# EAGLE design BeoModern_display (EAGLE 8.6.3)
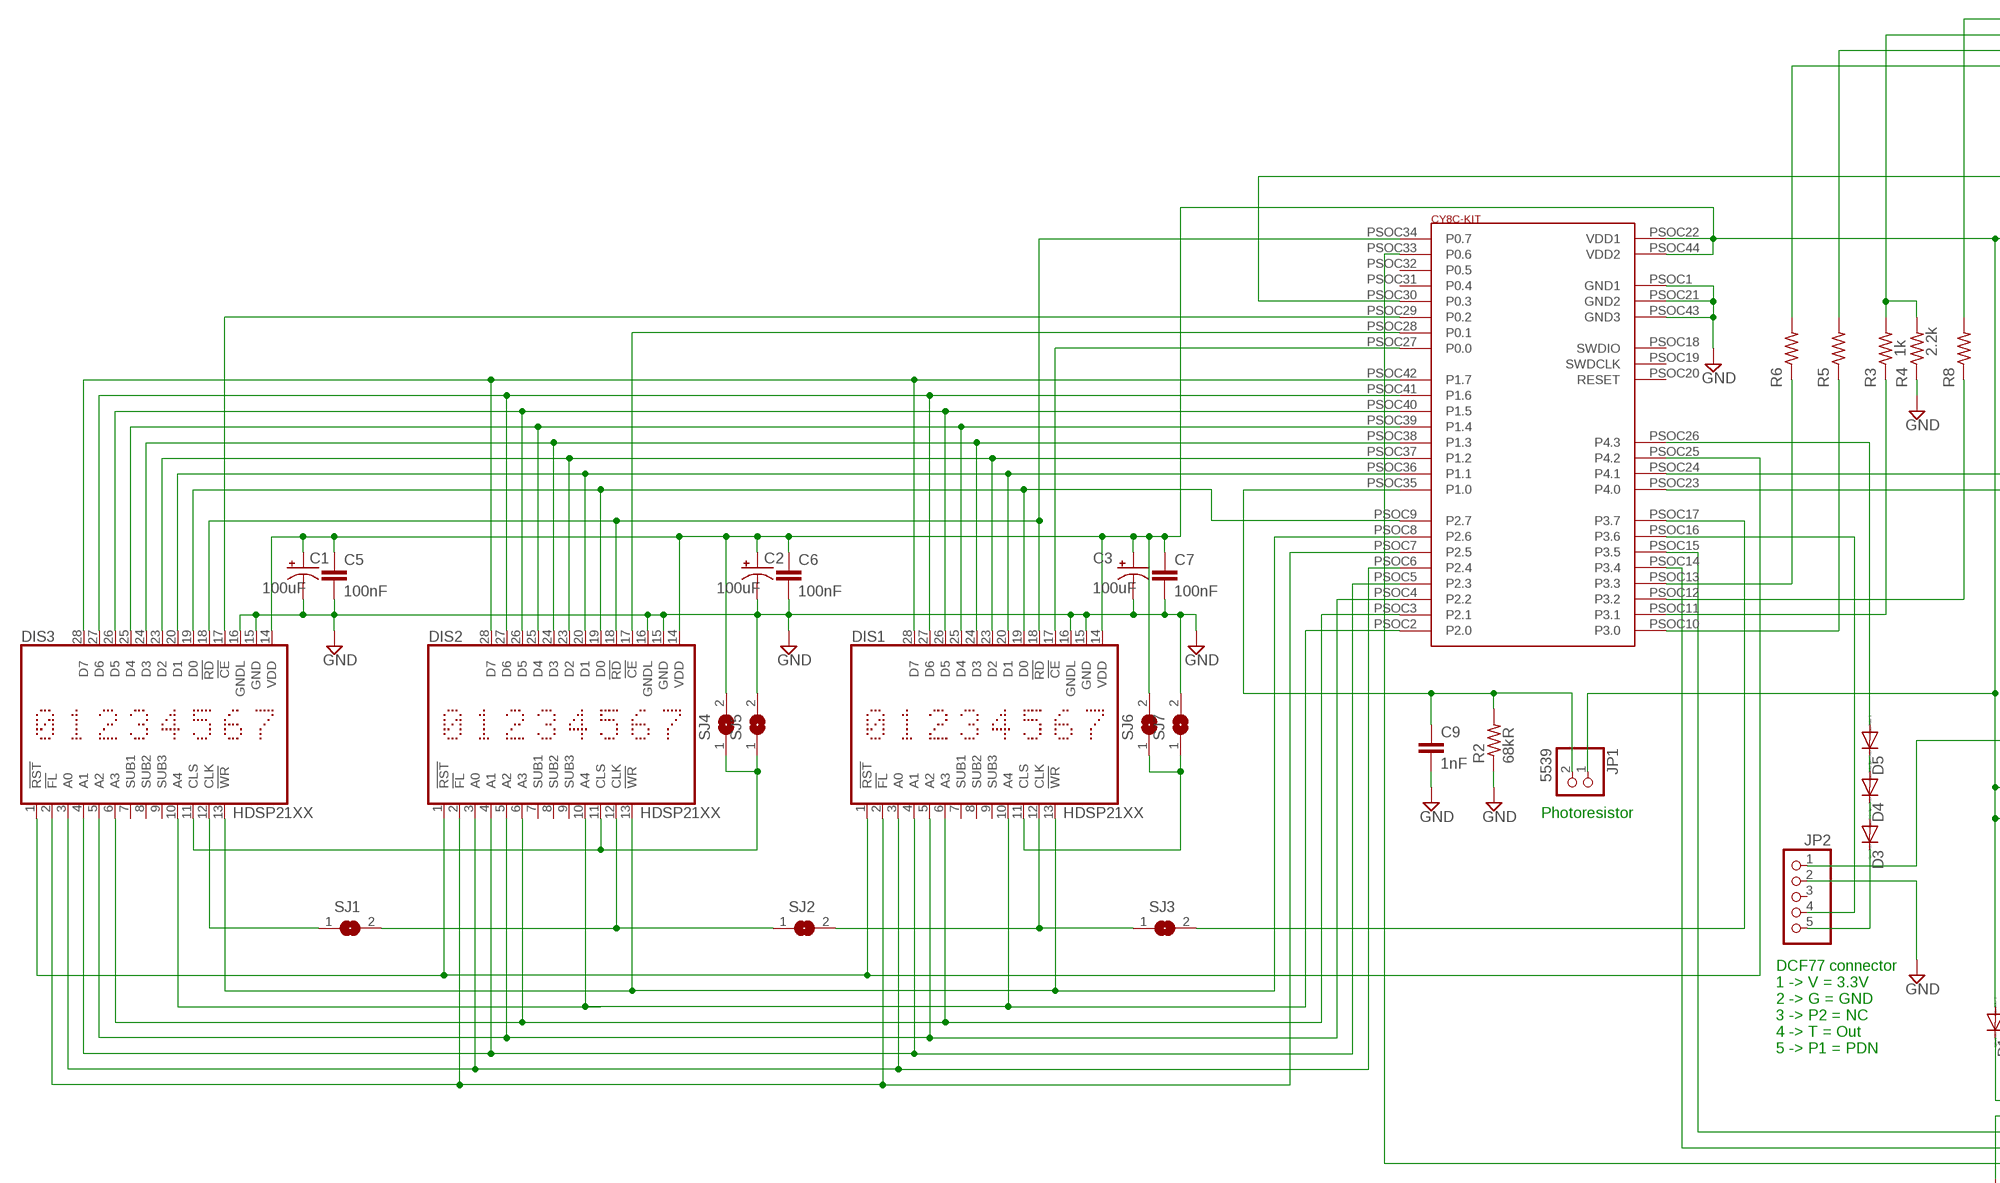
[diagram p0: schematic, sheet 1, part 1 of 2]
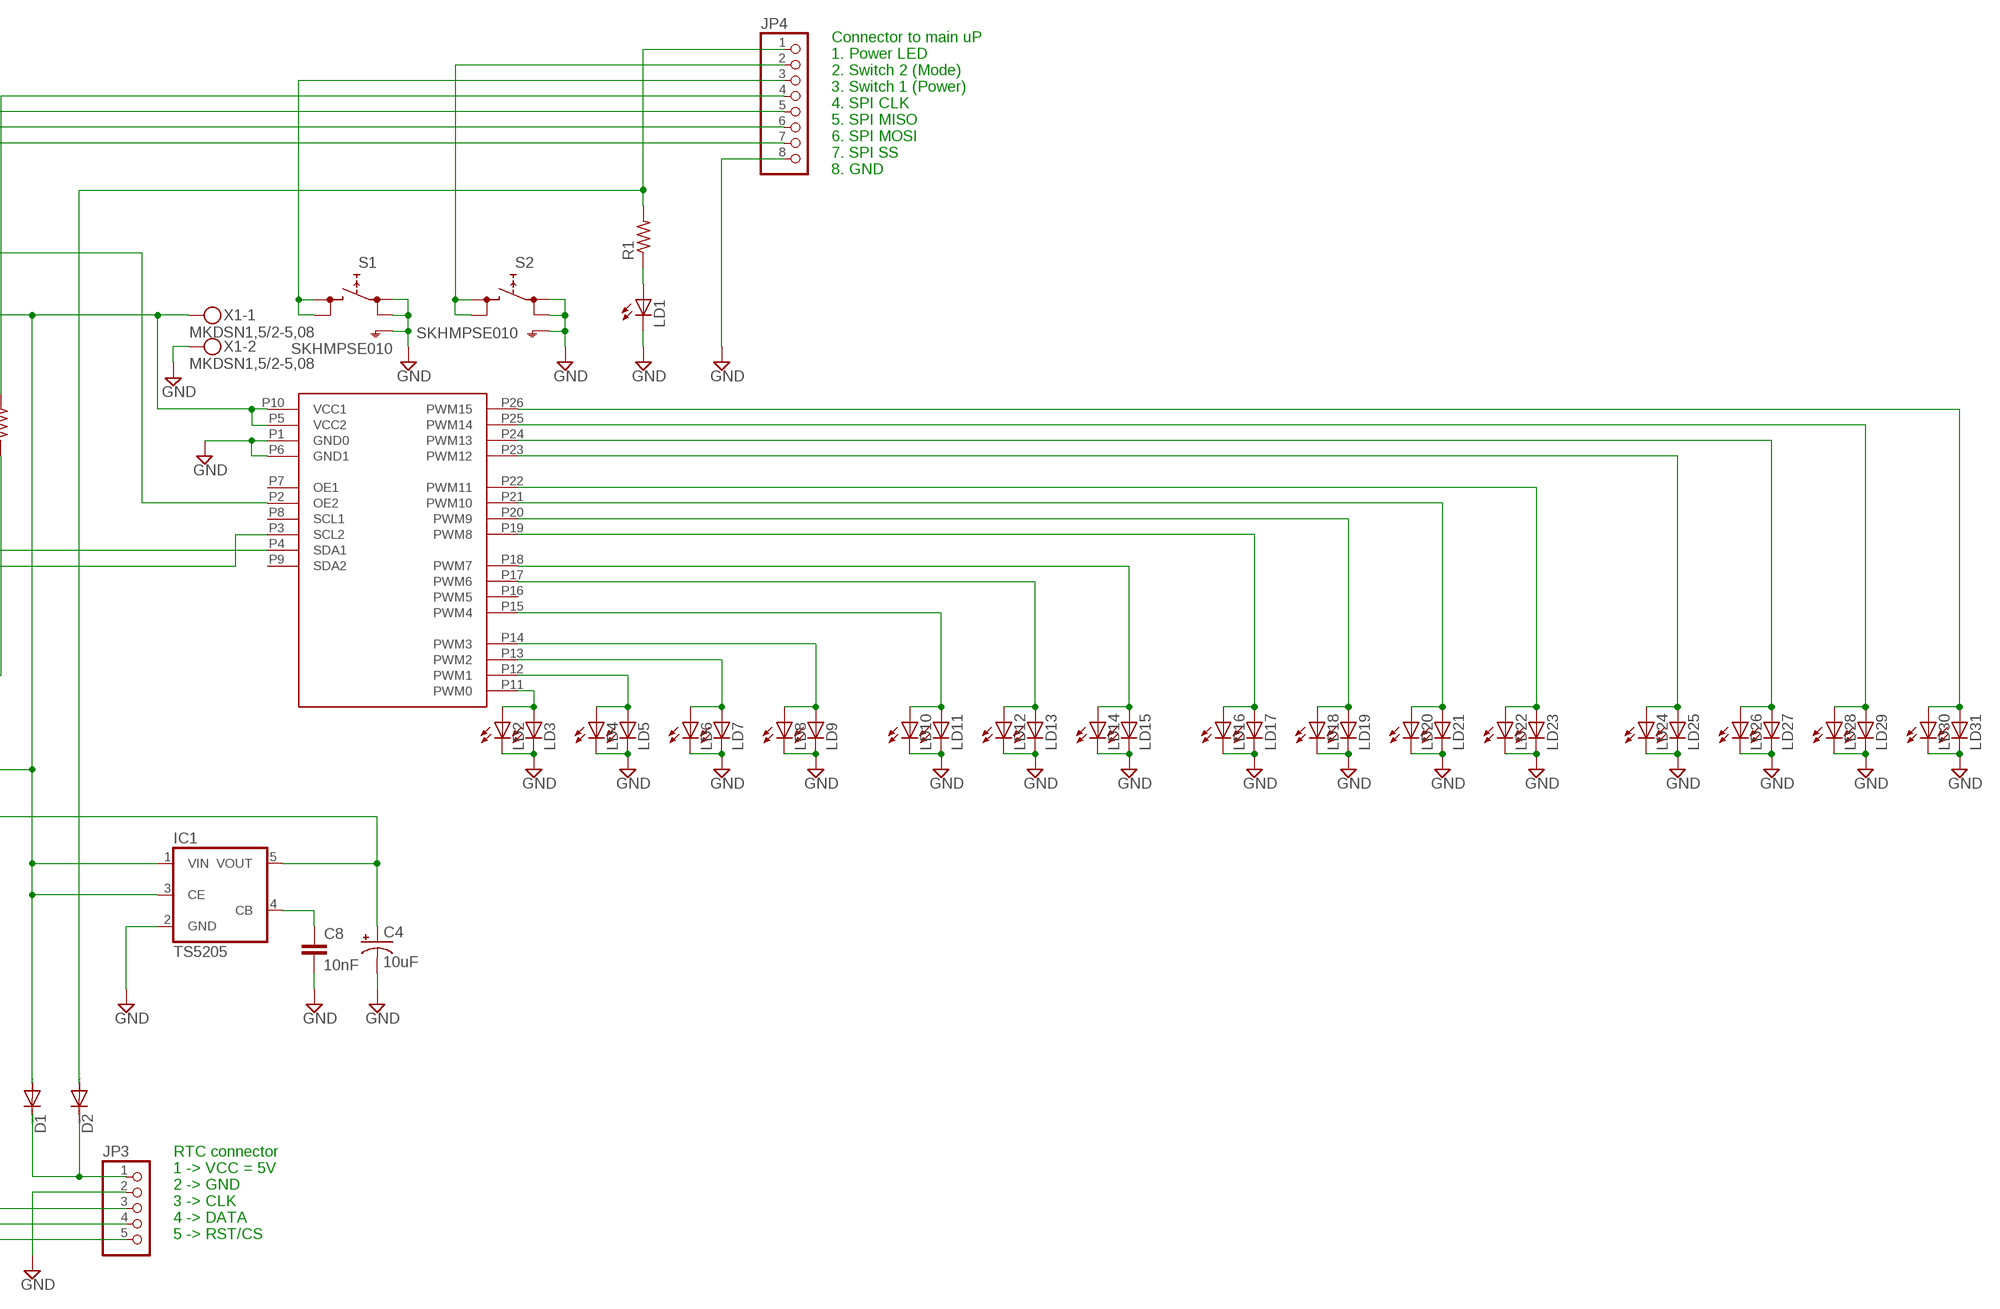
[diagram p1: schematic, sheet 1, part 2 of 2]

## Parts
C1  100uF  CPOL-USE15-5AXIAL  [E15-5]
C2  100uF  CPOL-USE15-5AXIAL  [E15-5]
C3  100uF  CPOL-USE15-5AXIAL  [E15-5]
C4  10uF  CPOL-USE2.5-5  [E2,5-5]
C5  100nF  C15/5  [C15B5]
C6  100nF  C15/5  [C15B5]
C7  100nF  C15/5  [C15B5]
C8  10nF  C2.5/2  [C2.5-2]
C9  1nF  C2.5/2  [C2.5-2]
D1  DIODE-SOD80C  [SOD80C]
D2  DIODE-SOD80C  [SOD80C]
D3  DIODE-SOD80C  [SOD80C]
D4  DIODE-SOD80C  [SOD80C]
D5  DIODE-SOD80C  [SOD80C]
DIS1  HDSP21XX  [HDSP21XX]
DIS2  HDSP21XX  [HDSP21XX]
DIS3  HDSP21XX  [HDSP21XX]
IC1  TS5205  [SOT25]
JP1  5539  PINHD-1X2  [1X02]
JP2  PINHD-1X5  [1X05]
JP3  PINHD-1X5  [1X05]
JP4  PINHD-1X8  [1X08]
LD1  TLLR4400  [LED3MM]
LD2  TLLR4400  [LED3MM]
LD3  TLLR4400  [LED3MM]
LD4  TLLR4400  [LED3MM]
LD5  TLLR4400  [LED3MM]
LD6  TLLR4400  [LED3MM]
LD7  TLLR4400  [LED3MM]
LD8  TLLR4400  [LED3MM]
LD9  TLLR4400  [LED3MM]
LD10  TLLR4400  [LED3MM]
LD11  TLLR4400  [LED3MM]
LD12  TLLR4400  [LED3MM]
LD13  TLLR4400  [LED3MM]
LD14  TLLR4400  [LED3MM]
LD15  TLLR4400  [LED3MM]
LD16  TLLR4400  [LED3MM]
LD17  TLLR4400  [LED3MM]
LD18  TLLR4400  [LED3MM]
LD19  TLLR4400  [LED3MM]
LD20  TLLR4400  [LED3MM]
LD21  TLLR4400  [LED3MM]
LD22  TLLR4400  [LED3MM]
LD23  TLLR4400  [LED3MM]
LD24  TLLR4400  [LED3MM]
LD25  TLLR4400  [LED3MM]
LD26  TLLR4400  [LED3MM]
LD27  TLLR4400  [LED3MM]
LD28  TLLR4400  [LED3MM]
LD29  TLLR4400  [LED3MM]
LD30  TLLR4400  [LED3MM]
LD31  TLLR4400  [LED3MM]
R1  R-US_0207/10  [0207/10]
R2  68kR  R-US_0207/10  [0207/10]
R3  1k  R-US_0207/10  [0207/10]
R4  2.2k  R-US_0207/10  [0207/10]
R5  R-US_0207/10  [0207/10]
R6  R-US_0207/10  [0207/10]
R8  R-US_0207/10  [0207/10]
S1  SKHMPSE010  [SKHMPXE010]
S2  SKHMPSE010  [SKHMPXE010]
SJ1  SJ  [SJ]
SJ2  SJ  [SJ]
SJ3  SJ  [SJ]
SJ4  SJ  [SJ]
SJ5  SJ  [SJ]
SJ6  SJ  [SJ]
SJ7  SJ  [SJ]
U$9  CY8C-KIT  [CY8C-KIT-FOOTPRINT]
U$10  PCA9685  [PCA9685_FOOTPRINT]
X1  MKDSN1,5/2-5,08  [MKDSN1,5/2-5,08]

## Nets
GND: C1.- C2.- C3.- C4.- C5.2 C6.2 C7.2 C8.2 C9.2 DIS1.15(GND) DIS1.16(GNDL) DIS2.15(GND) DIS2.16(GNDL) DIS3.15(GND) DIS3.16(GNDL) IC1.2(GND) JP2.2 JP3.2 JP4.8 LD1.K(C) LD2.K(C) LD3.K(C) LD4.K(C) LD5.K(C) LD6.K(C) LD7.K(C) LD8.K(C) LD9.K(C) LD10.K(C) LD11.K(C) LD12.K(C) LD13.K(C) LD14.K(C) LD15.K(C) LD16.K(C) LD17.K(C) LD18.K(C) LD19.K(C) LD20.K(C) LD21.K(C) LD22.K(C) LD23.K(C) LD24.K(C) LD25.K(C) LD26.K(C) LD27.K(C) LD28.K(C) LD29.K(C) LD30.K(C) LD31.K(C) R2.1 R4.1 S1.1(1.1) S1.2(1.2) S1.5(SH) S2.1(1.1) S2.2(1.2) S2.5(SH) SJ5.2 SJ7.2 U$9.PSOC1(GND1) U$9.PSOC21(GND2) U$9.PSOC43(GND3) U$10.P1(GND0) U$10.P6(GND1) X1.2
N$1: LD14.A LD15.A U$10.P18(PWM7)
N$2: LD12.A LD13.A U$10.P17(PWM6)
N$3: U$9.PSOC24(P4.1) U$10.P4(SDA1)
N$4: LD10.A LD11.A U$10.P15(PWM4)
N$5: LD1.A R1.1
N$6: JP2.4 U$9.PSOC16(P3.6)
N$7: U$9.PSOC23(P4.0) U$10.P3(SCL2)
N$8: R5.1 U$9.PSOC10(P3.0)
N$9: LD30.A LD31.A U$10.P26(PWM15)
N$10: LD28.A LD29.A U$10.P25(PWM14)
N$11: LD26.A LD27.A U$10.P24(PWM13)
N$12: LD24.A LD25.A U$10.P23(PWM12)
N$13: R6.1 U$9.PSOC13(P3.3)
N$14: R8.1 U$9.PSOC12(P3.2)
N$36: JP4.6 R5.2
N$38: JP4.4 R8.2
N$39: JP4.7 R6.2
N$40: DIS2.11(CLS) DIS3.11(CLS) SJ4.1 SJ5.1
N$41: C8.1 IC1.4(CB)
N$42: JP4.2 S2.3(2.1) S2.4(2.2)
N$43: D2.A JP4.1 R1.2
N$72: JP4.5 R3.2 R4.2
N$73: DIS2.12(CLK) SJ1.2 SJ2.1
N$74: R3.1 U$9.PSOC11(P3.1)
N$75: SJ3.2 U$9.PSOC17(P3.7)
N$76: DIS1.12(CLK) SJ2.2 SJ3.1
N$79: DIS1.11(CLS) SJ6.1 SJ7.1
N$80: DIS3.12(CLK) SJ1.1
N$81: DIS1.19(D0) DIS2.19(D0) DIS3.19(D0) U$9.PSOC9(P2.7)
N$82: DIS1.13(!WR) DIS2.13(!WR) DIS3.13(!WR) U$9.PSOC8(P2.6)
N$83: DIS1.28(D7) DIS2.28(D7) DIS3.28(D7) U$9.PSOC42(P1.7)
N$84: DIS1.27(D6) DIS2.27(D6) DIS3.27(D6) U$9.PSOC41(P1.6)
N$85: DIS1.26(D5) DIS2.26(D5) DIS3.26(D5) U$9.PSOC40(P1.5)
N$86: DIS1.25(D4) DIS2.25(D4) DIS3.25(D4) U$9.PSOC39(P1.4)
N$87: DIS1.24(D3) DIS2.24(D3) DIS3.24(D3) U$9.PSOC38(P1.3)
N$88: DIS1.23(D2) DIS2.23(D2) DIS3.23(D2) U$9.PSOC37(P1.2)
N$89: DIS1.20(D1) DIS2.20(D1) DIS3.20(D1) U$9.PSOC36(P1.1)
N$90: DIS1.18(!RD) DIS2.18(!RD) DIS3.18(!RD) U$9.PSOC34(P0.7)
N$91: DIS3.17(!CE) U$9.PSOC29(P0.2)
N$92: DIS2.17(!CE) U$9.PSOC28(P0.1)
N$93: DIS1.17(!CE) U$9.PSOC27(P0.0)
N$94: DIS1.10(A4) DIS2.10(A4) DIS3.10(A4) U$9.PSOC2(P2.0)
N$95: DIS1.1(!RST) DIS2.1(!RST) DIS3.1(!RST) U$9.PSOC25(P4.2)
N$96: DIS1.6(A3) DIS2.6(A3) DIS3.6(A3) U$9.PSOC3(P2.1)
N$97: DIS1.5(A2) DIS2.5(A2) DIS3.5(A2) U$9.PSOC4(P2.2)
N$98: DIS1.4(A1) DIS2.4(A1) DIS3.4(A1) U$9.PSOC5(P2.3)
N$99: DIS1.3(A0) DIS2.3(A0) DIS3.3(A0) U$9.PSOC6(P2.4)
N$100: DIS1.2(!FL) DIS2.2(!FL) DIS3.2(!FL) U$9.PSOC7(P2.5)
N$103: U$9.PSOC30(P0.3) U$10.P2(OE2)
N$106: D5.A U$9.PSOC26(P4.3)
N$108: LD22.A LD23.A U$10.P22(PWM11)
N$109: LD20.A LD21.A U$10.P21(PWM10)
N$110: LD18.A LD19.A U$10.P20(PWM9)
N$111: LD16.A LD17.A U$10.P19(PWM8)
N$116: LD8.A LD9.A U$10.P14(PWM3)
N$117: LD6.A LD7.A U$10.P13(PWM2)
N$118: LD4.A LD5.A U$10.P12(PWM1)
N$119: LD2.A LD3.A U$10.P11(PWM0)
N$120: C4.+ IC1.5(VOUT) JP2.1
N$121: JP4.3 S1.3(2.1) S1.4(2.2)
N$124: C9.1 JP1.2 R2.2 U$9.PSOC35(P1.0)
N$125: JP3.3 U$9.PSOC15(P3.5)
N$126: JP3.4 U$9.PSOC14(P3.4)
N$127: JP3.5 U$9.PSOC33(P0.6)
N$128: D3.C JP2.5
N$129: D4.A D5.C
N$130: D3.A D4.C
N$131: D1.C D2.C JP3.1
N$133: C1.+ C2.+ C3.+ C5.1 C6.1 C7.1 D1.A DIS1.14(VDD) DIS2.14(VDD) DIS3.14(VDD) IC1.1(VIN) IC1.3(CE) JP1.1 SJ4.2 SJ6.2 U$9.PSOC22(VDD1) U$9.PSOC44(VDD2) U$10.P5(VCC2) U$10.P10(VCC1) X1.1
Unconnected: DIS1.7(SUB1) DIS1.8(SUB2) DIS1.9(SUB3) DIS2.7(SUB1) DIS2.8(SUB2) DIS2.9(SUB3) DIS3.7(SUB1) DIS3.8(SUB2) DIS3.9(SUB3) JP2.3 U$9.PSOC18(SWDIO) U$9.PSOC19(SWDCLK) U$9.PSOC20(RESET) U$9.PSOC31(P0.4) U$9.PSOC32(P0.5) U$10.P7(OE1) U$10.P8(SCL1) U$10.P9(SDA2) U$10.P16(PWM5)

## Notes on the sheet
- Connector to main uP
  1. Power LED
  2. Switch 2 (Mode)
  3. Switch 1 (Power)
  4. SPI CLK 
  5. SPI MISO
  6. SPI MOSI
  7. SPI SS
  8. GND
- Photoresistor
- DCF77 connector
  1 -> V = 3.3V
  2 -> G = GND
  3 -> P2 = NC
  4 -> T = Out
  5 -> P1 = PDN
- RTC connector
  1 -> VCC = 5V
  2 -> GND
  3 -> CLK
  4 -> DATA
  5 -> RST/CS

## Library data of the parts
C1-C4 = rcl:CPOL-US: POLARIZED CAPACITOR, American symbol; SPICEPREFIX: C
C5-C9 = capacitor-wima:C: CAPACITOR naming: grid - package width
D1-D5 = diode:DIODE-: DIODE
DIS1-DIS3 = display-hp:HDSP21XX: LED DISPLAY 8-character dot matrix; MF: AGILENT TECHNOLOGIES; MPN: HDSP-2179; OC_FARNELL: 1175588; OC_NEWARK: 06B1344
IC1 = v-reg:TS5205: 150mA Low Noise LDO Voltage Regulator with Enable TSC [Taiwan Semiconductor Company, Ltd] Source: http://www.taiwansemi.com .. 5205_0409c.pdf
JP1 = pinhead:PINHD-1X2: PIN HEADER
JP2 JP3 = pinhead:PINHD-1X5: PIN HEADER
JP4 = pinhead:PINHD-1X8: PIN HEADER
LD1-LD31 = led:TLLR4400: Low Current (2mA) LED 3 mm Tinted Diffused Package color RED Source: Data sheet <http://www.farnell.com/datasheets/391100.pdf>; MF: VISHAY SEMICONDUCTOR; OC_FARNELL: 1612437
R1-R6 R8 = rcl:R-US_: RESISTOR, American symbol; SPICEPREFIX: R
S1 S2 = switch:SKHMP*E010: 6.2 X 6.5mm TACT Switch (SMD) Source: http://www3.alps.co.jp/WebObjects/catalog.woa/PDF/E/Switch/Tact/SKHM/SKHM.PDF
SJ1-SJ7 = jumper:SJ: SMD solder JUMPER
U$9 = CY8C-KIT:CY8C-KIT
U$10 = PCA9685:PCA9685
X1 = con-phoenix-508:MKDSN1,5/2-5,08: MKDSN 1,5/ 2-5,08 Printklemme Nennstrom: 13,5 A Nennspannung: 250 V Rastermaß: 5,08 mm Polzahl: 2 Anschlussart: Schraubanschluss Montage: Löten Anschlussrichtung Leiter/Platine: 0 ° Artikelnummer: 1729128 Source: http://eshop.phoenixcontact.com .. 1729128.pdf

## Board
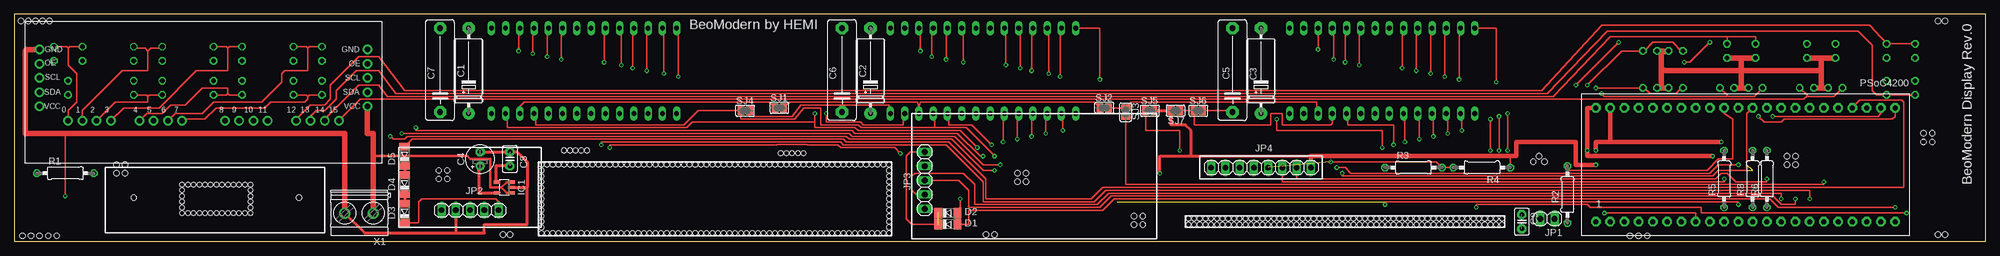
[diagram p2: board, top side]
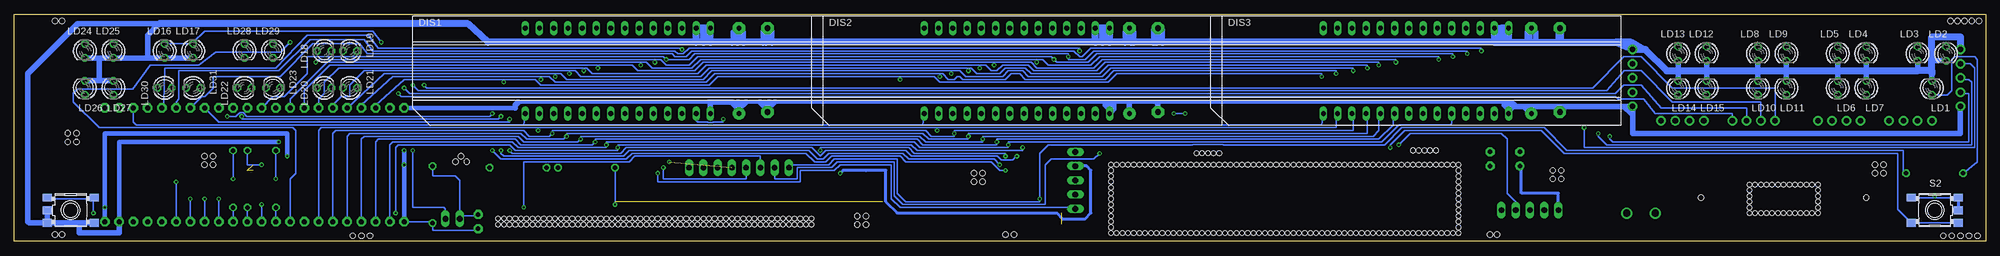
[diagram p3: board, bottom side, seen from below]

Size 351.46 x 40.63 mm. Coordinates in mm from the lower left corner, seen from the top.
Outline: 0,0 351.46,0 351.46,40.63 0,40.63 0,0
Copper layers (1*16): Top 0.035mm / dielectric 1.5mm / Bottom 0.035mm
Design rules "default": minimum track width 6mil, minimum drill 0.35mm, track to track 6mil, track to pad 6mil, pad to pad 6mil, via to via 6mil, smd to smd 6mil, copper to edge 40mil, drill to drill 6mil, minimum pad ring 10mil, minimum via ring 8mil, stop-mask expansion 4mil, vias tented up to drill 0mil, thermal gap 10mil
Holes 1 mm at 344.17,1.27 342.9,1.27 344.17,39.37 342.9,39.37 1.27,39.37 2.54,39.37 3.81,39.37 5.08,39.37 6.35,39.37 88.39,1.27 87.12,1.27 174.75,1.27 173.23,1.27 50.8,7.87 21.34,7.87 288.04,1.02 289.56,1.02 291.08,1.02 6.1,1.02 4.57,1.02 3.05,1.02 1.52,1.02 7.62,1.02 75.69,12.7 77.22,12.7 77.22,11.18 75.69,11.18 178.82,12.19 180.34,12.19 180.34,10.67 178.82,10.67 315.98,15.24 317.5,15.24 315.98,13.72 317.5,13.72 340.36,19.3 341.88,19.3 340.36,17.78 341.88,17.78 18.29,13.72 19.81,13.72 19.81,12.19 18.29,12.19 272.8,14.22 270.76,14.22 271.78,15.24 199.64,4.57 201.17,4.57 201.17,3.05 199.64,3.05
Holes 0.85 mm at 98.04,16.26 99.06,16.26 100.08,16.26 101.09,16.26 102.11,16.26 93.98,13.72 95,13.72 96.01,13.72 97.03,13.72 98.04,13.72 99.06,13.72 100.08,13.72 101.09,13.72 102.11,13.72 103.12,13.72 104.14,13.72 105.16,13.72 106.17,13.72 107.19,13.72 108.2,13.72 109.22,13.72 110.24,13.72 111.25,13.72 112.27,13.72 113.28,13.72 114.3,13.72 115.32,13.72 116.33,13.72 117.35,13.72 118.36,13.72 119.38,13.72 120.4,13.72 121.41,13.72 122.43,13.72 123.44,13.72 124.46,13.72 125.48,13.72 126.49,13.72 127.51,13.72 128.52,13.72 129.54,13.72 130.56,13.72 131.57,13.72 132.59,13.72 133.6,13.72 134.62,13.72 135.64,13.72 136.65,13.72 137.67,13.72 138.68,13.72 139.7,13.72 140.72,13.72 141.73,13.72 142.75,13.72 143.76,13.72 144.78,13.72 145.8,13.72 146.81,13.72 147.83,13.72 148.84,13.72 149.86,13.72 150.88,13.72 151.89,13.72 152.91,13.72 153.92,13.72 154.94,13.72 155.96,13.72 155.96,12.7 155.96,11.68 155.96,10.67 155.96,9.65 155.96,8.64 155.96,7.62 155.96,6.6 155.96,5.59 155.96,4.57 155.96,3.56 155.96,2.54 93.98,12.7 93.98,11.68 93.98,10.67 93.98,9.65 93.98,8.64 93.98,7.62 93.98,6.6 93.98,5.59 93.98,4.57 93.98,3.56 93.98,2.54 95,1.52 96.01,1.52 97.03,1.52 98.04,1.52 99.06,1.52 100.08,1.52 101.09,1.52 102.11,1.52 103.12,1.52 104.14,1.52 105.16,1.52 106.17,1.52 107.19,1.52 108.2,1.52 109.22,1.52 110.24,1.52 111.25,1.52 112.27,1.52 113.28,1.52 114.3,1.52 115.32,1.52 116.33,1.52 117.35,1.52 118.36,1.52 119.38,1.52 120.4,1.52 121.41,1.52 122.43,1.52 123.44,1.52 124.46,1.52 125.48,1.52 126.49,1.52 127.51,1.52 128.52,1.52 129.54,1.52 130.56,1.52 131.57,1.52 132.59,1.52 133.6,1.52 134.62,1.52 135.64,1.52 136.65,1.52 137.67,1.52 138.68,1.52 139.7,1.52 140.72,1.52 141.73,1.52 142.75,1.52 143.76,1.52 144.78,1.52 145.8,1.52 146.81,1.52 147.83,1.52 148.84,1.52 149.86,1.52 150.88,1.52 151.89,1.52 152.91,1.52 153.92,1.52 154.94,1.52 93.98,1.52 155.96,1.52 30.99,5.08 32,5.08 33.02,5.08 34.04,5.08 35.05,5.08 36.07,5.08 37.08,5.08 38.1,5.08 39.12,5.08 40.13,5.08 41.15,5.08 42.16,5.08 30.99,10.16 32,10.16 33.02,10.16 34.04,10.16 35.05,10.16 36.07,10.16 37.08,10.16 38.1,10.16 39.12,10.16 40.13,10.16 41.15,10.16 42.16,10.16 209.3,3.05 210.31,3.05 211.33,3.05 212.34,3.05 213.36,3.05 214.38,3.05 215.39,3.05 216.41,3.05 217.42,3.05 218.44,3.05 219.46,3.05 220.47,3.05 221.49,3.05 222.5,3.05 223.52,3.05 224.54,3.05 225.55,3.05 226.57,3.05 227.58,3.05 228.6,3.05 229.62,3.05 230.63,3.05 231.65,3.05 232.66,3.05 233.68,3.05 234.7,3.05 235.71,3.05 236.73,3.05 237.74,3.05 238.76,3.05 239.78,3.05 240.79,3.05 241.81,3.05 242.82,3.05 243.84,3.05 244.86,3.05 245.87,3.05 246.89,3.05 247.9,3.05 248.92,3.05 249.94,3.05 250.95,3.05 251.97,3.05 252.98,3.05 254,3.05 255.02,3.05 256.03,3.05 257.05,3.05 258.06,3.05 259.08,3.05 260.1,3.05 261.11,3.05 262.13,3.05 263.14,3.05 264.16,3.05 265.18,3.05 209.3,4.06 210.31,4.06 211.33,4.06 212.34,4.06 213.36,4.06 214.38,4.06 215.39,4.06 216.41,4.06 217.42,4.06 218.44,4.06 219.46,4.06 220.47,4.06 221.49,4.06 222.5,4.06 223.52,4.06 224.54,4.06 225.55,4.06 226.57,4.06 227.58,4.06 228.6,4.06 229.62,4.06 230.63,4.06 231.65,4.06 232.66,4.06 233.68,4.06 234.7,4.06 235.71,4.06 236.73,4.06 237.74,4.06 238.76,4.06 239.78,4.06 240.79,4.06 241.81,4.06 242.82,4.06 243.84,4.06 244.86,4.06 245.87,4.06 246.89,4.06 247.9,4.06 248.92,4.06 249.94,4.06 250.95,4.06 251.97,4.06 252.98,4.06 254,4.06 255.02,4.06 256.03,4.06 257.05,4.06 258.06,4.06 259.08,4.06 260.1,4.06 261.11,4.06 262.13,4.06 263.14,4.06 264.16,4.06 265.18,4.06 42.16,9.14 42.16,8.13 42.16,7.11 42.16,6.1 29.97,5.08 29.97,10.16 29.97,9.14 29.97,8.13 29.97,7.11 29.97,6.1 136.65,15.75 137.67,15.75 138.68,15.75 139.7,15.75 140.72,15.75

### Footprints (pad centres in the part's own frame; a part is rotated, then mirrored left to right if it is on the bottom)
E15-5 = drill 0.813 pad 2.159: + -7.62,0 | drill 0.813 pad 2.159 octagon: - 7.62,0
E2,5-5 = drill 0.813 pad 1.6: + -1.27,0 | drill 0.813 pad 1.6 octagon: - 1.27,0
C15B5 = drill 1.016 pad 2.159 octagon: 1 -7.493,0; 2 7.493,0
C2.5-2 = drill 0.813 pad 1.6 octagon: 1 -1.27,0; 2 1.27,0
SOD80C = smd 1.4 x 1.8: A 1.7,0; C -1.7,0
HDSP21XX = drill 0.813 long: 1 -16.51,-7.62; 2 -13.97,-7.62; 3 -11.43,-7.62; 4 -8.89,-7.62; 5 -6.35,-7.62; 6 -3.81,-7.62; 7 -1.27,-7.62; 8 1.27,-7.62; 9 3.81,-7.62; 10 6.35,-7.62; 11 8.89,-7.62; 12 11.43,-7.62; 13 13.97,-7.62; 14 16.51,-7.62; 15 16.51,7.62; 16 13.97,7.62; 17 11.43,7.62; 18 8.89,7.62; 19 6.35,7.62; 20 3.81,7.62; 21 1.27,7.62; 22 -1.27,7.62; 23 -3.81,7.62; 24 -6.35,7.62; 25 -8.89,7.62; 26 -11.43,7.62; 27 -13.97,7.62; 28 -16.51,7.62
SOT25 = smd 0.55 x 1.2: 1 -0.95,-1.3; 2 0,-1.3; 3 0.95,-1.3; 4 0.95,1.3; 5 -0.95,1.3
1X02 = drill 1.016 long: 1 -1.27,0; 2 1.27,0
1X05 = drill 1.016 long: 1 -5.08,0; 2 -2.54,0; 3 0,0; 4 2.54,0; 5 5.08,0
1X08 = drill 1.016 long: 1 -8.89,0; 2 -6.35,0; 3 -3.81,0; 4 -1.27,0; 5 1.27,0; 6 3.81,0; 7 6.35,0; 8 8.89,0
LED3MM = drill 0.813 octagon: A -1.27,0; K 1.27,0
0207/10 = drill 0.813 octagon: 1 -5.08,0; 2 5.08,0
SKHMPXE010 = smd 1.6 x 1.4: 1 -4.2,2.25; 2 4.2,2.25; 3 -4.2,-2.25; 4 4.2,-2.25; 5 4.2,0
SJ = smd 1.168 x 1.6: 1 -0.762,0; 2 0.762,0
CY8C-KIT-FOOTPRINT = drill 0.9 pad 1.676 octagon: PSOC1 -49.53,-11.43; PSOC2 -46.99,-11.43; PSOC3 -44.45,-11.43; PSOC4 -41.91,-11.43; PSOC5 -39.37,-11.43; PSOC6 -36.83,-11.43; PSOC7 -34.29,-11.43; PSOC8 -31.75,-11.43; PSOC9 -29.21,-11.43; PSOC10 -26.67,-11.43; PSOC11 -24.13,-11.43; PSOC12 -21.59,-11.43; PSOC13 -19.05,-11.43; PSOC14 -16.51,-11.43; PSOC15 -13.97,-11.43; PSOC16 -11.43,-11.43; PSOC17 -8.89,-11.43; PSOC18 -6.35,-11.43; PSOC19 -3.81,-11.43; PSOC20 -1.27,-11.43; PSOC21 1.27,-11.43; PSOC22 3.81,-11.43; PSOC23 3.81,8.89; PSOC24 1.27,8.89; PSOC25 -1.27,8.89; PSOC26 -3.81,8.89; PSOC27 -6.35,8.89; PSOC28 -8.89,8.89; PSOC29 -11.43,8.89; PSOC30 -13.97,8.89; PSOC31 -16.51,8.89; PSOC32 -19.05,8.89; PSOC33 -21.59,8.89; PSOC34 -24.13,8.89; PSOC35 -26.67,8.89; PSOC36 -29.21,8.89; PSOC37 -31.75,8.89; PSOC38 -34.29,8.89; PSOC39 -36.83,8.89; PSOC40 -39.37,8.89; PSOC41 -41.91,8.89; PSOC42 -44.45,8.89; PSOC43 -46.99,8.89; PSOC44 -49.53,8.89
PCA9685_FOOTPRINT = drill 1 pad 1.676: P1 -27.94,3.81; P2 -27.94,1.27; P3 -27.94,-1.27; P4 -27.94,-3.81; P5 -27.94,-6.35; P6 30.48,3.81; P7 30.48,1.27; P8 30.48,-1.27; P9 30.48,-3.81; P10 30.48,-6.35; P11 -22.86,-8.89; P12 -20.32,-8.89; P13 -17.78,-8.89; P14 -15.24,-8.89; P15 -10.16,-8.89; P16 -7.62,-8.89; P17 -5.08,-8.89; P18 -2.54,-8.89; P19 5.08,-8.89; P20 7.62,-8.89; P21 10.16,-8.89; P22 12.7,-8.89; P23 17.78,-8.89; P24 20.32,-8.89; P25 22.86,-8.89; P26 25.4,-8.89
MKDSN1,5/2-5,08 = drill 1.3 pad 2: 1 -2.561,0.025; 2 2.519,0.025

### Placement (x,y rotation side)
C1  81.03,30.48 90 top
C2  152.65,30.48 90 top
C3  222.25,30.48 90 top
C4  83.06,14.73 90 top
C5  217.17,30.61 90 top
C6  147.57,30.61 90 top
C7  75.95,30.61 90 top
C8  88.39,14.73 90 top
C9  268.73,3.56 270 top
D1  166.45,3.05 0 top
D2  166.45,5.08 0 top
D3  69.6,5.08 90 top
D4  69.6,10.16 90 top
D5  69.6,15.24 90 top
DIS1  243.84,30.48 0 bottom
DIS2  172.72,30.48 0 bottom
DIS3  101.6,30.48 0 bottom
IC1  87.38,9.65 90 top
JP1  273.3,4.06 180 top
JP2  81.28,5.59 0 top
JP3  162.31,10.92 270 top
JP4  222.25,13.21 0 top
LD1  9.65,27.43 90 bottom
LD2  7.11,33.53 270 bottom
LD3  12.19,33.53 270 bottom
LD4  21.34,33.53 270 bottom
LD5  26.42,33.53 270 bottom
LD6  26.42,27.43 90 bottom
LD7  21.34,27.43 90 bottom
LD8  40.64,33.53 270 bottom
LD9  35.56,33.53 270 bottom
LD10  40.64,27.43 90 bottom
LD11  35.56,27.43 90 bottom
LD12  49.78,33.53 270 bottom
LD13  54.86,33.53 270 bottom
LD14  54.86,27.43 90 bottom
LD15  49.78,27.43 90 bottom
LD16  324.61,34.04 270 bottom
LD17  319.53,34.04 270 bottom
LD18  296.16,34.04 0 bottom
LD19  291.59,34.04 180 bottom
LD20  296.16,27.43 0 bottom
LD21  291.59,27.43 180 bottom
LD22  310.39,27.43 0 bottom
LD23  305.31,27.43 180 bottom
LD24  338.84,34.04 270 bottom
LD25  333.76,34.04 270 bottom
LD26  338.84,27.43 90 bottom
LD27  333.76,27.43 90 bottom
LD28  310.39,34.04 270 bottom
LD29  305.31,34.04 270 bottom
LD30  324.61,27.43 0 bottom
LD31  319.53,27.43 180 bottom
R1  9.14,12.19 0 top
R2  276.86,8.38 90 top
R3  249.43,13.21 0 top
R4  261.62,13.21 180 top
R5  304.8,11.18 90 top
R6  312.42,11.18 90 top
R8  309.88,11.18 90 top
S1  341.38,5.59 180 bottom
S2  9.14,5.59 0 bottom
SJ1  136.4,23.88 0 top
SJ2  194.31,23.88 0 top
SJ3  198.12,23.11 270 top
SJ4  130.3,23.37 0 top
SJ5  202.44,23.37 0 top
SJ6  211.07,23.37 0 top
SJ7  207.01,23.37 180 top
U$9  331.47,14.99 0 top
U$10  32.51,30.48 0 top
X1  61.47,5.08 180 top

### Tracks (layer width: path | path; a pad name or v marks a point on that pad's centre or on a via)
GND  (via drill 0.35)
  Top 0.254: 206.5,23.11 SJ7.2 | 9.14,19.3 v9.14,8.13 | R4.1 266.7,15.24
  Top 0.508: X1.2 62.48,1.52 78.74,1.52 | 78.74,1.52 83.82,1.52 83.82,3.05 91.44,3.05 91.44,9.65 | 91.44,9.65 91.44,14.22 89.66,16 C8.2 C4.- | IC1.2 91.44,9.65 | v204.22,12.19 204.22,15.24 209.8,15.24 | 209.8,15.24 209.8,19.81 208.79,20.83 206.25,20.83 206.25,22.86 206.5,23.11 | SJ5.2 SJ7.2 | 209.8,15.24 231.14,15.24 | JP2.2 78.74,1.52
  Top 0.813: v304.29,17.78 284.48,17.78 | 284.48,17.78 281.94,17.78 v281.94,16.26 | U$9.PSOC43 284.48,17.78 | v281.94,13.72 278.38,13.72 278.38,17.78 267.72,17.78 267.72,15.24 266.7,15.24 231.14,15.24 JP4.8
  Top 1.016: LD19.K 294.13,34.04 | 294.13,34.04 LD18.K | LD21.K 293.62,27.43 | 293.62,27.43 LD20.K | 294.13,34.04 293.62,33.53 293.62,30.99 | 293.62,30.99 293.62,27.43 | LD28.K 307.85,32.77 | 307.85,32.77 LD29.K | LD23.K 307.85,27.43 | 307.85,27.43 LD22.K | 293.62,30.99 294.13,30.48 307.85,30.48 | 307.85,30.48 307.85,32.77 | 307.85,30.48 307.85,27.43 | LD16.K 322.07,32.77 | 322.07,32.77 LD17.K | LD31.K 322.07,27.43 | 322.07,27.43 LD30.K | 307.85,30.48 322.07,30.48 | 322.07,30.48 322.07,32.77 | 322.07,30.48 322.07,27.43 | U$10.P1 2.29,34.29 2.03,34.04 2.03,19.3 9.14,19.3 58.95,19.3 X1.2
  Bottom 0.254: U$9.PSOC1 277.11,3.56 R2.1 276.86,2.03 268.99,2.03 C9.2 | 13.05,8.13 S2.1 9.43,7.84 v9.14,8.13 8.85,7.84 S2.2
  Bottom 0.508: S2.2 S2.5 | v204.22,12.19 203.71,12.7 199.64,12.68 196.09,12.7 196.09,7.11 194.06,5.08 165.61,5.08 164.59,4.06 160.53,4.06 159.51,5.08 159.51,12.7 160.27,13.46 JP3.2
  Bottom 0.813: U$9.PSOC21 332.74,17.78 v304.29,17.78 | v281.94,16.26 v281.94,13.72 U$9.PSOC1
  Bottom 1.016: LD13.K 54.86,30.48 LD14.K | LD12.K 49.78,30.48 LD15.K | LD10.K 40.64,30.48 LD8.K | LD9.K 35.56,30.48 LD11.K | LD5.K 26.42,30.48 LD6.K | LD4.K 21.34,30.48 LD7.K | LD3.K 12.19,30.48 | LD2.K 9.65,32.26 9.65,29.97 LD1.K | LD24.K 336.3,32.77 | 336.3,32.77 LD25.K 327.66,32.77 | LD26.K 336.3,28.7 | 336.3,28.7 LD27.K | 336.3,32.77 336.3,28.7 | 327.66,32.77 LD16.K LD17.K | 327.66,32.77 327.66,36.83 325.63,38.86 340.11,38.86 349,29.97 349,3.56 348.78,3.34 S1.2 | U$9.PSOC21 332.74,1.52 339.85,1.52 339.85,3.34 | 339.85,3.34 340.07,3.34 S1.2 | S1.1 339.85,3.34 | S1.2 S1.5 | 151.89,35.56 151.89,37.34 C2.- | 146.81,35.56 146.81,37.85 C6.2 | 153.42,35.56 153.42,37.34 C2.- | 148.34,35.56 148.34,37.85 C6.2 | 75.69,35.56 75.69,37.85 C7.2 76.2,37.85 76.2,35.56 | C1.- 80.26,37.34 80.26,35.56 | C1.- 81.79,37.34 81.79,35.56 | C1.- 81.28,37.85 81.28,35.56 | C6.2 147.57,35.81 147.83,35.56 | C2.- 152.65,35.81 152.4,35.56 | C5.2 217.17,37.59 216.41,37.59 216.41,35.56 | C5.2 217.17,36.07 217.93,37.59 217.93,35.56 | C5.2 217.68,35.81 217.42,35.56 | C3.- 221.49,37.34 221.49,35.56 | C3.- 223.27,37.34 223.27,36.22 222.91,35.87 | 222.5,36.07 222.91,35.87 | 222.91,35.87 223.52,35.56 | C3.- 222.5,37.85 | 222.5,36.07 222.5,35.56 | C3.- 222.25,36.32 222.5,36.07
  Bottom 1.27: 60.96,34.29 60.71,34.29 56.9,30.48 54.86,30.48 49.78,30.48 40.64,30.48 35.56,30.48 26.42,30.48 21.34,30.48 12.19,30.48 9.65,30.48 | 60.96,34.29 U$10.P6 66.04,35.56 | 87.63,35.56 DIS3.16 86.36,38.1 | 156.21,35.56 DIS2.15 157.48,38.1 | 87.63,35.56 146.81,35.56 147.83,35.56 148.34,35.56 151.89,35.56 152.4,35.56 153.42,35.56 156.21,35.56 | 156.21,35.56 157.48,35.56 | 157.48,35.56 158.75,35.56 | 158.75,35.56 DIS2.16 157.48,38.1 | 158.75,35.56 216.41,35.56 217.42,35.56 217.93,35.56 221.49,35.56 222.5,35.56 223.52,35.56 227.33,35.56 | 227.33,35.56 DIS1.15 228.6,38.1 | 227.33,35.56 228.6,35.56 | 228.6,35.56 229.87,35.56 | 229.87,35.56 DIS1.16 228.6,38.1 | 229.87,35.56 266.95,35.56 270.51,38.86 325.63,38.86 | 87.63,35.56 86.36,35.56 | 86.36,35.56 85.09,35.56 | 85.09,35.56 85.09,36.83 | 85.09,36.83 DIS3.15 86.36,38.1 | 85.09,35.56 81.79,35.56 81.28,35.56 80.26,35.56 76.2,35.56 75.69,35.56 66.04,35.56 | 86.36,38.1 85.09,36.83 | 86.36,38.1 86.36,35.56 | 157.48,38.1 157.48,35.56 | 228.6,38.1 228.6,35.56 | 60.96,34.29 63.25,35.56 66.04,35.56 | 9.65,30.48 9.65,29.97 | 9.65,30.48 9.65,32.26 9.65,36.58 4.57,36.58 U$10.P1
N$1
  Top 0.254: LD14.A 52.58,26.16 52.32,25.91 | 52.32,25.91 52.32,25.4 51.82,24.89 45.72,24.89 44.7,23.88 36.07,23.88 34.04,21.84 30.23,21.84 U$10.P18 | LD15.A 52.07,26.16 52.32,25.91
N$2
  Top 0.254: U$10.P17 28.7,22.86 33.53,22.86 35.56,24.89 44.2,24.89 47.75,28.45 47.75,29.97 48.26,30.48 52.32,30.48 52.32,34.54 | 52.32,34.54 52.07,34.8 LD12.A | 52.32,34.54 52.58,34.8 LD13.A
N$3  (via drill 0.35)
  Top 0.254: v67.06,18.8 67.56,18.29 69.6,18.29 70.1,18.8 148.34,18.8 148.84,18.29 167.13,18.29 172.72,12.7 v174.75,12.7 | v266.19,16.26 v266.19,22.86 | v313.44,22.35 332.23,22.35 332.74,22.86 U$9.PSOC24
  Bottom 0.254: U$10.P4 4.32,26.42 3.05,26.42 3.05,17.78 66.55,17.78 67.06,18.29 v67.06,18.8 | v174.75,12.7 175.77,12.7 177.29,14.22 192.53,14.22 193.55,15.24 205.74,15.24 206.76,14.22 208.79,14.22 210.31,15.75 241.3,15.75 242.32,14.73 264.67,14.73 v266.19,16.26 | v266.19,22.86 266.7,22.35 309.97,22.35 310.62,23.01 311.17,23.01 311.32,22.86 311.4,22.86 311.91,22.35 v313.44,22.35
N$4
  Top 0.254: U$10.P15 23.62,22.86 26.42,22.86 27.94,24.38 30.48,24.38 33.53,27.43 38.1,27.43 38.1,26.42 | 38.1,26.42 37.85,26.16 LD11.A | LD10.A 38.35,26.16 38.1,26.42
N$5
  Bottom 0.254: LD1.A 6.86,26.16 6.1,26.92 6.1,32.51 5.59,33.02 2.03,33.02 1.52,32.51 1.52,14.22 R1.1
N$6  (via drill 0.35)
  Top 0.254: v104.65,17.27 104.65,17.78 147.32,17.78 147.83,17.27 166.12,17.27 172.72,10.67 172.72,7.11 192.53,7.11 194.56,9.14 320.04,9.14 v320.04,7.62
  Bottom 0.254: v104.65,17.27 102.62,19.3 86.36,19.3 85.34,18.29 85.34,8.64 83.82,7.11 JP2.4 | U$9.PSOC16 v320.04,7.62
N$7  (via drill 0.35)
  Top 0.254: v69.09,19.3 148.84,19.3 149.35,18.8 167.64,18.8 172.72,13.72 v175.77,13.72 | v264.67,16.26 v264.67,22.35 | v310.9,22.35 311.91,21.34 314.96,21.34 315.47,21.84 334.77,21.84 335.28,22.35 U$9.PSOC23
  Bottom 0.254: U$10.P3 4.32,28.96 3.05,28.96 2.54,28.45 2.54,17.27 67.56,17.27 69.09,18.8 v69.09,19.3 | v175.77,13.72 176.78,14.73 192.02,14.73 193.04,15.75 206.25,15.75 207.26,14.73 208.28,14.73 209.8,16.26 241.81,16.26 242.82,15.24 264.16,15.24 264.67,15.75 v264.67,16.26 | v264.67,22.35 265.18,21.84 310.9,21.84 v310.9,22.35
N$8
  Bottom 0.254: U$9.PSOC10 R5.1
N$9
  Top 0.254: U$10.P26 61.72,25.4 319.02,25.4 319.66,26.04 | LD30.A 324.36,25.91 319.79,25.91 319.66,26.04 | 319.66,26.04 LD31.A
N$10
  Top 0.254: 305.31,36.58 310.39,36.58 LD28.A | 305.31,36.58 284.48,36.58 274.32,25.91 66.55,25.91 65.02,27.94 61.98,27.94 61.47,27.94 55.37,21.84 U$10.P25 | LD29.A 305.31,36.58
N$11
  Top 0.254: LD26.A LD27.A 331.98,26.16 331.22,26.92 331.22,35.05 328.68,37.59 283.97,37.59 273.3,26.42 68.07,26.42 65.02,30.48 60.96,30.48 57.4,26.92 57.4,25.4 55.37,23.37 53.85,23.37 52.83,22.35 U$10.P24
N$12
  Top 0.254: LD24.A LD25.A 330.71,38.61 282.96,38.61 272.29,26.92 69.6,26.92 65.02,33.02 61.47,33.02 56.39,27.94 56.39,25.4 55.37,24.38 52.83,24.38 50.29,21.84 U$10.P23
N$13
  Bottom 0.254: R6.1 U$9.PSOC13
N$14
  Bottom 0.254: U$9.PSOC12 R8.1
N$36  (via drill 0.35)
  Top 0.254: JP4.6 226.06,10.67 304.8,10.67 v304.8,11.18
  Bottom 0.254: v304.8,11.18 R5.2
N$38  (via drill 0.35)  (1 unrouted)
  Top 0.254: v235.71,13.21 237.24,13.21 238.25,12.19 302.26,12.19 303.78,13.72 v307.34,13.72
  Bottom 0.254: JP4.4 220.98,11.18 235.71,11.18 v235.71,13.21 | 308.86,13.72 v307.34,13.72 309.88,13.72 R8.2
N$39  (via drill 0.35)
  Top 0.254: JP4.7 228.6,11.18 303.28,11.18 304.29,12.19 305.31,12.19 306.83,10.67 312.42,10.67 v312.42,11.18
  Bottom 0.254: v312.42,11.18 R6.2
N$40  (via drill 0.35)
  Top 0.254: DIS3.11 92.96,22.61 92.96,20.83 119.38,20.83 121.92,23.37 SJ4.1 129.54,21.84 139.19,21.84 140.72,23.88 143.76,23.88 143.76,20.83 150.49,20.83 151,20.32 164.08,20.32 | v207.77,16.26 207.77,19.81 201.68,19.81 SJ5.1 | v174.75,15.24 169.67,20.32 164.08,20.32 | 164.08,20.32 164.08,22.86 DIS2.11
  Bottom 0.254: v207.77,16.26 207.77,16.76 192.02,16.76 191.01,15.75 174.75,15.75 v174.75,15.24
N$41
  Top 0.508: C8.1 85.85,13.46 85.85,10.83 IC1.4
N$42  (via drill 0.35)
  Top 0.254: v106.17,16.76 106.17,17.27 135.96,17.27 136,17.32 141.37,17.32 141.41,17.27 146.81,17.27 147.32,16.76 156.97,16.76 v157.99,15.75
  Bottom 0.254: S2.4 S2.3 15.75,5.74 15.75,15.75 75.18,15.75 79.25,19.81 103.63,19.81 106.17,17.27 v106.17,16.76 | JP4.2 215.9,11.18 211.84,11.18 211.84,13.21 205.74,13.21 204.72,14.22 194.56,14.22 194.56,8.13 193.04,6.6 167.64,6.6 167.64,13.72 166.62,14.73 159,14.73 v157.99,15.75
N$43  (via drill 0.35)
  Top 0.254: D2.A 168.66,5.59 v168.66,7.62
  Bottom 0.254: R1.2 14.73,12.19 14.73,16.26 74.68,16.26 78.74,20.32 104.14,20.32 107.19,17.27 135.96,17.27 136,17.32 141.37,17.32 141.41,17.27 167.13,17.27 168.66,15.75 v168.66,7.62 168.66,7.11 192.53,7.11 194.06,8.64 194.06,14.73 205.23,14.73 206.25,13.72 212.85,13.72 JP4.1
N$72  (via drill 0.35)  (1 unrouted)
  Top 0.254: R4.2 R3.2 253.49,14.22 v234.7,14.22
N$73
  Top 0.254: 161.29,23.62 161.54,24.89 192.53,24.89 SJ2.1 | 161.29,23.62 161.04,24.89 138.18,24.89 SJ1.2 | 161.29,23.62 DIS2.12
N$74  (via drill 0.35)  (1 unrouted)
  Top 0.254: v307.34,6.6 307.34,7.11 244.35,7.11 v244.35,6.6
  Bottom 0.254: v307.34,6.6 U$9.PSOC11 | v244.35,6.6 R3.1
N$75  (via drill 0.35)
  Top 0.254: SJ3.2 198.12,10.16 322.58,10.16 v322.58,10.67
  Bottom 0.254: U$9.PSOC17 v322.58,10.67
N$76
  Top 0.254: SJ2.2 SJ3.1 199.14,24.89 232.16,24.89 232.16,22.86 DIS1.12
N$79
  Top 0.254: SJ7.1 SJ6.1 210.31,20.83 224.03,20.83 224.03,22.77 224.12,22.86 226.06,22.86 226.06,20.83 234.7,20.83 234.95,21.08 DIS1.11
N$80
  Top 0.254: DIS3.12 90.17,24.13 90.93,24.89 134.62,24.89 SJ1.1
N$81  (via drill 0.35)
  Top 0.254: v166.12,32.51 166.12,38.1 DIS2.19 | v95,33.02 95,38.1 DIS3.19 | v237.24,32 237.24,38.1 DIS1.19 | v297.69,32 298.7,32 v302.26,35.56
  Bottom 0.254: v95,33.02 95,33.53 158.5,33.53 160.02,32 165.61,32 v166.12,32.51 166.62,33.02 229.62,33.02 231.14,31.5 235.2,31.5 236.22,32.51 237.24,32.51 | 237.24,32.51 v237.24,32 | U$9.PSOC9 302.26,11.18 301.24,12.19 301.24,19.81 301.75,20.32 336.3,20.32 340.87,24.89 340.87,26.48 340.09,27.25 330.32,27.25 327.15,31.5 318.52,31.5 315.47,33.86 303.9,33.86 303.39,34.42 v302.26,35.56 | v297.69,32 297.18,32.51 237.24,32.51
N$82  (via drill 0.35)
  Top 0.254: v243.84,16.76 243.84,19.81 225.04,19.81 v225.04,21.84 | v283.46,5.08 299.72,5.08 U$9.PSOC8 | v144.78,22.86 144.78,21.34 150.88,21.34 151.38,20.83 158.5,20.83 158.5,22.86 DIS2.13 | v171.7,16.76 168.66,19.81 150.44,19.81 149.86,20.32 142.75,20.32 v142.75,22.86 142.75,21.34 120.9,21.34 119.89,20.32 87.88,20.32 87.88,22.86 DIS3.13
  Bottom 0.254: v171.7,16.76 171.7,16.26 190.5,16.26 191.52,17.27 243.84,17.27 v243.84,16.76 243.84,16.26 262.13,16.26 263.14,17.27 282.96,17.27 283.46,16.76 v283.46,5.08 | v142.75,22.86 v144.78,22.86 | v225.04,21.84 225.04,21.34 226.87,21.34 226.94,21.26 227.72,21.26 227.79,21.34 229.62,21.34 229.87,21.59 DIS1.13
N$83  (via drill 0.35)
  Top 0.254: v193.55,28.96 193.55,38.1 DIS2.28 | v118.36,29.46 118.36,38.1 DIS3.28 | v264.16,28.45 264.16,38.1 DIS1.28
  Bottom 0.254: v118.36,29.46 118.36,29.97 154.94,29.97 156.46,28.45 186.44,28.45 187.45,29.46 193.55,29.46 | U$9.PSOC42 287.02,24.38 281.94,28.96 264.16,28.96 | 193.55,29.46 226.06,29.46 227.58,27.94 257.56,27.94 258.57,28.96 264.16,28.96 | v193.55,28.96 193.55,29.46 | 264.16,28.96 v264.16,28.45
N$84  (via drill 0.35)
  Top 0.254: v115.82,29.97 115.82,38.1 DIS3.27 | v257.56,28.96 257.56,38.1 DIS1.27 | v186.44,29.46 186.44,38.1 DIS2.27
  Bottom 0.254: 257.56,29.46 v257.56,28.96 | 257.56,29.46 283.97,29.46 289.56,24.38 U$9.PSOC41 | 186.44,29.97 v186.44,29.46 | 186.44,29.97 226.57,29.97 228.09,28.45 255.02,28.45 256.03,29.46 257.56,29.46 | v115.82,29.97 115.82,30.48 155.45,30.48 156.97,28.96 171.2,28.96 172.21,29.97 173.74,29.97 174.75,28.96 182.37,28.96 182.88,29.46 183.39,29.46 183.9,28.96 184.91,28.96 185.93,29.97 186.44,29.97
N$85  (via drill 0.35)
  Top 0.254: v112.78,30.48 112.78,38.1 DIS3.26 | v184.4,29.97 184.4,38.1 DIS2.26 | v255.02,29.46 255.02,38.1 DIS1.26
  Bottom 0.254: v112.78,30.48 112.78,30.99 155.96,30.99 157.48,29.46 170.69,29.46 171.7,30.48 174.24,30.48 175.26,29.46 181.86,29.46 182.88,30.48 184.4,30.48 | 255.02,29.97 285.5,29.97 U$9.PSOC40 | v255.02,29.46 255.02,29.97 | v184.4,29.97 184.4,30.48 | 184.4,30.48 227.08,30.48 228.6,28.96 252.98,28.96 254,29.97 255.02,29.97
N$86  (via drill 0.35)
  Top 0.254: v181.36,30.48 181.36,38.1 DIS2.25 | v110.24,30.99 110.24,38.1 DIS3.25 | v252.48,29.97 252.48,38.1 DIS1.25
  Bottom 0.254: 252.48,30.48 289.05,30.48 291.59,27.94 291.59,25.91 293.12,25.91 294.64,24.38 U$9.PSOC39 | v252.48,29.97 252.48,30.48 | 181.36,30.99 227.58,30.99 229.11,29.46 250.44,29.46 251.46,30.48 252.48,30.48 | v110.24,30.99 110.24,31.5 156.46,31.5 157.99,29.97 170.18,29.97 171.2,30.99 174.75,30.99 175.77,29.97 179.83,29.97 180.85,30.99 181.36,30.99 | 181.36,30.99 v181.36,30.48
N$87  (via drill 0.35)
  Top 0.254: v108.2,31.5 108.2,38.1 DIS3.24 | v249.94,30.48 249.94,38.1 DIS1.24 | v179.32,30.99 179.32,38.1 DIS2.24
  Bottom 0.254: v108.2,31.5 108.2,32 156.97,32 158.5,30.48 169.67,30.48 170.69,31.5 175.26,31.5 176.28,30.48 177.29,30.48 178.31,31.5 179.32,31.5 | 179.32,31.5 228.09,31.5 229.62,29.97 248.41,29.97 249.43,30.99 249.94,30.99 | U$9.PSOC38 297.18,25.4 296.16,26.42 296.16,28.45 293.62,30.99 249.94,30.99 | v249.94,30.48 249.94,30.99 | 179.32,31.5 v179.32,30.99
N$88  (via drill 0.35)
  Top 0.254: v105.16,32 105.16,38.1 DIS3.23 | v176.78,31.5 176.78,38.1 DIS2.23 | v247.4,30.99 247.4,38.1 DIS1.23
  Bottom 0.254: v105.16,32 105.16,32.51 157.48,32.51 159,30.99 169.16,30.99 170.18,32 176.78,32 | 247.4,31.5 295.15,31.5 299.72,26.92 U$9.PSOC37 | 247.4,31.5 241.3,31.5 240.28,30.48 230.12,30.48 228.6,32 176.78,32 | 247.4,31.5 v247.4,30.99 | 176.78,32 v176.78,31.5
N$89  (via drill 0.35)
  Top 0.254: v97.54,32.51 97.54,38.1 DIS3.20 | v169.16,32 169.16,38.1 DIS2.20 | v239.78,31.5 239.78,38.1 DIS1.20
  Bottom 0.254: v97.54,32.51 97.54,33.02 157.99,33.02 159.51,31.5 167.13,31.5 168.15,32.51 169.16,32.51 | 239.78,32 295.66,32 302.26,25.4 U$9.PSOC36 | 239.78,32 v239.78,31.5 | 169.16,32.51 v169.16,32 | 169.16,32.51 229.11,32.51 230.63,30.99 237.74,30.99 238.76,32 239.78,32
N$90  (via drill 0.35)
  Top 0.254: v92.46,33.53 92.46,38.1 DIS3.18 | v163.58,33.02 163.58,38.1 DIS2.18 | v235.2,32.51 235.2,38.1 DIS1.18
  Bottom 0.254: v92.46,33.53 92.46,34.04 159,34.04 160.53,32.51 163.58,32.51 v163.58,33.02 163.58,33.53 230.12,33.53 231.14,32.51 v235.2,32.51 235.71,33.02 299.21,33.02 299.21,29.97 303.28,25.91 305.31,25.91 U$9.PSOC34
N$91  (via drill 0.35)
  Top 0.254: v89.92,34.04 89.92,38.1 DIS3.17
  Bottom 0.254: v89.92,34.04 89.92,34.54 159.51,34.54 161.04,33.02 161.54,33.02 162.56,34.04 230.63,34.04 231.65,33.02 233.68,33.02 234.19,33.53 288.54,33.53 289.81,35.31 298.2,35.31 304.04,29.46 315.98,29.46 315.98,27.43 317.5,25.91 318.01,25.91 U$9.PSOC29
N$92  (via drill 0.35)
  Top 0.254: v161.54,34.04 161.54,38.1 DIS2.17
  Bottom 0.254: v161.54,34.04 161.54,34.54 231.14,34.54 232.16,33.53 233.17,33.53 233.68,34.04 287.53,34.04 289.05,36.07 298.7,36.07 304.29,30.48 322.07,30.48 322.07,25.4 322.58,24.89 U$9.PSOC28
N$93  (via drill 0.35)
  Top 0.254: DIS1.17 v232.41,34.29
  Bottom 0.254: v232.41,34.29 232.66,34.54 286.51,34.54 288.29,36.83 299.21,36.83 304.8,30.99 324.61,30.99 324.79,24.71 U$9.PSOC27
N$94  (via drill 0.35)
  Top 0.254: v174.24,17.27 170.69,20.83 166.62,20.83 166.62,22.86 DIS2.10 | v245.87,17.27 245.87,20.83 237.74,20.83 237.74,22.61 DIS1.10
  Bottom 0.254: U$9.PSOC2 284.48,17.27 283.97,17.78 262.64,17.78 261.62,16.76 245.87,16.76 v245.87,17.27 245.87,17.78 191.01,17.78 189.99,16.76 174.24,16.76 v174.24,17.27 174.24,17.78 107.7,17.78 104.65,20.83 95.5,20.83 95.25,21.08 DIS3.10
N$95
  Bottom 0.254: DIS2.1 189.48,20.83 | 189.48,20.83 260.6,20.83 | 260.6,20.83 DIS1.1 | DIS3.1 118.36,20.83 189.48,20.83 | 260.6,20.83 329.69,20.83 330.2,21.34 U$9.PSOC25
N$96  (via drill 0.35)
  Top 0.254: v176.28,17.78 176.28,22.86 DIS2.6 | v247.9,17.78 247.9,22.86 DIS1.6
  Bottom 0.254: DIS3.6 105.66,22.86 105.66,20.83 108.2,18.29 176.28,18.29 v176.28,17.78 176.28,17.27 189.48,17.27 190.5,18.29 247.9,18.29 v247.9,17.78 248.41,17.27 261.11,17.27 262.13,18.29 286.51,18.29 287.02,17.78 U$9.PSOC3
N$97  (via drill 0.35)
  Top 0.254: v178.82,18.29 178.82,22.86 DIS2.5 | v250.44,18.29 250.44,22.86 DIS1.5
  Bottom 0.254: DIS3.5 108.2,22.86 108.2,19.81 109.22,18.8 178.82,18.8 v178.82,18.29 178.82,17.78 188.98,17.78 189.99,18.8 250.44,18.8 v250.44,18.29 250.95,17.78 260.6,17.78 261.62,18.8 289.05,18.8 289.56,18.29 U$9.PSOC4
N$98  (via drill 0.35)
  Top 0.254: v181.36,18.8 181.36,22.86 DIS2.4 | v252.98,18.8 252.98,22.86 DIS1.4
  Bottom 0.254: DIS3.4 110.24,22.86 110.24,19.3 181.36,19.3 v181.36,18.8 181.36,18.29 188.47,18.29 189.48,19.3 252.98,19.3 v252.98,18.8 253.49,18.29 260.1,18.29 261.11,19.3 291.59,19.3 292.1,18.8 U$9.PSOC5
N$99  (via drill 0.35)
  Top 0.254: v183.9,19.3 183.9,22.86 DIS2.3 | v255.52,19.3 255.52,22.86 DIS1.3
  Bottom 0.254: DIS3.3 112.78,22.86 112.78,19.81 183.9,19.81 v183.9,19.3 183.9,18.8 187.96,18.8 188.98,19.81 255.52,19.81 v255.52,19.3 256.03,18.8 259.59,18.8 260.6,19.81 294.13,19.81 294.64,19.3 U$9.PSOC6
N$100  (via drill 0.35)
  Top 0.254: v186.94,19.81 186.94,22.86 DIS2.2 | v258.06,19.81 258.06,22.86 DIS1.2
  Bottom 0.254: DIS3.2 115.82,22.86 115.82,20.32 186.94,20.32 | 258.06,20.32 186.94,20.32 | v186.94,19.81 186.94,20.32 | v258.06,19.81 258.06,20.32 | 258.06,20.32 296.67,20.32 297.18,19.81 U$9.PSOC7
N$103  (via drill 0.35)
  Top 0.254: v263.14,16.26 v263.14,21.84 | v71.63,20.32 71.63,19.81 149.35,19.81 149.86,19.3 168.15,19.3 172.21,15.24 v172.72,15.24
  Bottom 0.254: U$9.PSOC30 314.96,21.34 263.14,21.34 v263.14,21.84 | v263.14,16.26 262.64,15.75 243.33,15.75 242.32,16.76 209.3,16.76 207.77,15.24 206.76,16.26 192.53,16.26 191.52,15.24 176.19,15.24 175.53,14.58 173.46,14.58 172.81,15.24 v172.72,15.24 | v71.63,20.32 71.63,16.76 2.03,16.76 2.03,30.99 2.79,31.75 U$10.P2
N$106
  Top 0.254: 69.77,16.94 D5.A 70.94,18.29 147.83,18.29 148.34,17.78 166.62,17.78 173.23,11.18 173.23,7.62 192.02,7.62 194.06,9.65 336.8,9.65 336.8,24.89 336.47,25.22 329.01,25.22 U$9.PSOC26
N$108  (via drill 0.35)
  Top 0.254: v282.96,26.42 283.46,25.91 305.31,25.91 305.44,26.04 | LD22.A 310.13,25.91 305.56,25.91 305.44,26.04 | 305.44,26.04 LD23.A
  Bottom 0.254: U$10.P22 45.21,22.86 58.93,22.86 60.96,25.4 65.53,25.4 66.04,25.91 282.45,25.91 v282.96,26.42
N$109  (via drill 0.35)
  Top 0.254: v281.94,27.43 LD21.A 290.58,27.43 291.59,26.42 296.16,26.42 297.18,27.43 LD20.A
  Bottom 0.254: U$10.P21 42.67,23.88 57.91,23.88 61.47,27.94 64.52,27.94 66.04,26.42 280.92,26.42 v281.94,27.43
N$110  (via drill 0.35)
  Top 0.254: v280.42,27.94 286.51,34.04 LD19.A 290.58,34.04 292.1,35.56 295.66,35.56 297.18,34.04 LD18.A
  Bottom 0.254: U$10.P20 40.13,24.89 55.88,24.89 61.47,30.48 64.45,30.48 67.56,26.92 279.4,26.92 v280.42,27.94
N$111  (via drill 0.35)
  Top 0.254: v278.38,27.94 v286,35.56
  Bottom 0.254: U$10.P19 37.59,27.43 55.88,27.43 61.47,33.02 64.52,33.02 70.1,27.43 277.88,27.43 v278.38,27.94 | LD16.A LD17.A 319.53,35.56 317.5,37.59 287.53,37.59 v286,35.56
N$116
  Top 0.254: U$10.P14 19.56,23.88 25.91,23.88 32.51,30.48 38.1,30.48 38.1,34.54 | 38.1,34.54 37.85,34.8 LD9.A | 38.1,34.54 38.35,34.8 LD8.A
N$117
  Top 0.254: U$10.P13 18.03,24.89 23.88,24.89 23.88,25.91 | 23.88,25.91 23.62,26.16 LD7.A | 23.88,25.91 24.13,26.16 LD6.A
N$118
  Top 0.254: U$10.P12 12.19,23.37 19.3,30.48 23.88,30.48 23.88,34.04 | 23.88,34.04 24.38,34.54 26.16,34.54 LD5.A | 23.88,34.04 23.37,34.54 21.59,34.54 LD4.A
N$119
  Top 0.254: U$10.P11 9.65,23.37 11.18,24.89 11.18,29.97 9.65,31.5 9.65,34.54 | 9.65,34.54 9.4,34.8 LD2.A | LD3.A 9.91,34.8 9.65,34.54
N$120
  Top 0.508: IC1.5 86.01,8.64 82.8,8.64 82.8,12.7 C4.+
  Bottom 0.508: JP2.1 76.2,8.64 82.8,8.64 82.8,13.21 C4.+
N$121  (via drill 0.35)
  Top 0.254: v337.31,5.08 300.74,5.08 300.74,6.1 280.92,6.1 280.42,6.6 260.6,6.6 v260.6,6.1
  Bottom 0.254: JP4.3 218.44,15.24 240.79,15.24 241.81,14.22 260.6,14.22 v260.6,6.1 | v337.31,5.08 337.31,7.62 S1.3 337.32,7.69 arc45 337.5,7.62 344.93,7.62 345.08,7.76 arc-45 345.25,7.84 S1.4
N$124
  Top 0.254: U$9.PSOC35 304.8,22.86 306.32,21.84 306.32,14.73 303.78,14.73 301.75,12.7 276.86,12.7 R2.2
  Bottom 0.254: R2.2 276.86,11.68 272.8,11.68 272.03,10.92 272.03,4.57 | JP1.2 272.03,4.57 | C9.1 268.99,4.57 272.03,4.57
N$125  (via drill 0.35)
  Top 0.254: v317.5,7.62 317.5,6.6 314.96,6.6 313.44,8.13 195.58,8.13 193.55,6.1 170.18,6.1 170.18,9.14 168.4,10.92 JP3.3
  Bottom 0.254: U$9.PSOC15 v317.5,7.62
N$126  (via drill 0.35)
  Top 0.254: v314.96,7.62 314.96,8.64 195.07,8.64 193.04,6.6 171.2,6.6 171.2,10.16 169.16,12.19 160.53,12.19 160.02,11.68 160.02,9.14 160.78,8.38 JP3.4
  Bottom 0.254: U$9.PSOC14 v314.96,7.62
N$127  (via drill 0.35)  (1 unrouted)
  Top 0.254: v236.73,12.19 236.73,11.68 302.77,11.68 303.78,12.7 308.86,12.7 308.86,22.86 U$9.PSOC33
  Bottom 0.254: v236.73,12.19 236.73,10.67 211.33,10.67 211.33,12.7 205.23,12.7 204.22,13.72 195.07,13.72 195.07,7.62 193.55,6.1 162.56,6.1 JP3.5
N$128
  Top 0.254: D3.C 71.96,3.38 72.14,3.56 72.14,7.11 72.64,7.62 85.85,7.62 86.36,7.11 JP2.5
N$129
  Top 0.254: 69.77,13.21 D5.C
  Top 0.508: D5.C D4.A
N$130
  Top 0.508: D4.C D3.A
N$131  (1 unrouted)
  Top 0.254: 165.1,5.08 D2.C | D1.C 160.02,3.05 159,4.06 159,15.24 159.77,16 JP3.1
N$133  (via drill 0.35)
  Top 0.254: SJ4.2 131.06,22.35 138.68,22.35 140.21,24.38 155.96,24.38 155.96,22.86 DIS2.14 | D1.A 170.18,3.05 170.18,5.59 194.06,5.59 196.09,7.62 312.93,7.62 314.45,6.1 v335.28,6.1 | SJ6.2 217.17,23.37 C5.1
  Top 0.406: IC1.1 87.82,8.7 86.87,9.65 | 86.87,9.65 87.82,10.6 IC1.3 | 86.87,9.65 84.84,9.65 84.84,14.73 81.28,14.73 80.77,15.24 64.01,15.24
  Top 0.813: v302.77,15.24 280.42,15.24 v280.42,16.26 280.42,23.88 U$9.PSOC44
  Top 1.016: U$10.P10 62.99,19.3 64.01,19.3 64.01,15.24 64.01,7.62 X1.1
  Bottom 0.254: v280.42,16.26 280.42,6.1 274.83,6.1 274.57,5.84 JP1.1
  Bottom 0.61: 84.33,24.13 84.84,24.13 DIS3.14 85.09,23.37 85.09,24.64 85.34,24.89 148.34,24.89 | 148.34,24.89 152.4,24.89 | 152.4,24.89 155.96,24.89 156.21,24.64 DIS2.14 156.46,23.11 156.46,24.89 215.9,24.89 216.92,24.89 218.44,24.89 220.98,24.89 222.5,24.89 227.08,24.89 227.33,24.64 227.33,24.38 | DIS1.14 227.58,23.11 227.58,24.89 261.62,24.89 | 152.65,24.38 152.65,24.64 152.4,24.89 | 147.57,24.64 148.34,24.89
  Bottom 0.813: v302.77,15.24 302.77,19.3 335.28,19.3 v335.28,6.1 U$9.PSOC22 | U$9.PSOC44 262.13,23.88
  Bottom 1.016: 62.99,22.86 U$10.P10 64.52,24.13 | 62.99,22.86 62.99,19.3 4.57,19.3 U$10.P5 | 64.52,24.13 75.18,24.13 | 75.18,24.13 76.96,24.13 | 76.96,24.13 81.28,24.13 | 81.28,24.13 82.3,24.13 | 82.3,24.13 83.82,24.13 | 83.82,24.13 84.33,24.13 85.09,23.37 | C2.+ 152.65,24.38 | C6.1 147.57,24.64 | 81.28,24.13 81.03,23.88 C1.+ 82.3,24.13 | 75.18,24.13 75.18,23.88 C7.1 76.96,24.13 | 83.82,24.13 84.33,24.64 85.09,24.64 | 64.52,24.13 63.25,22.86 62.99,22.86 | DIS3.14 85.09,23.62 85.85,24.38 | 155.45,24.38 155.45,23.62 DIS2.14 156.21,23.62 156.97,24.38 | DIS1.14 227.33,24.38 | 227.58,24.89 223.52,24.89 222.25,23.62 | 222.5,24.89 222.25,24.64 C3.+ 222.25,23.62 | 222.25,23.62 220.98,24.89 | 217.17,23.62 218.44,24.89 | 216.92,24.89 217.17,24.64 C5.1 217.17,23.62 | 217.17,23.62 215.9,24.89 | 262.13,23.88 262.13,24.38 261.62,24.89

### Text on the board
tPlace: BeoModern by HEMI | BeoModern Display Rev.0